# Altium schematic sheet EMoC_Page1.SchDoc
size A4
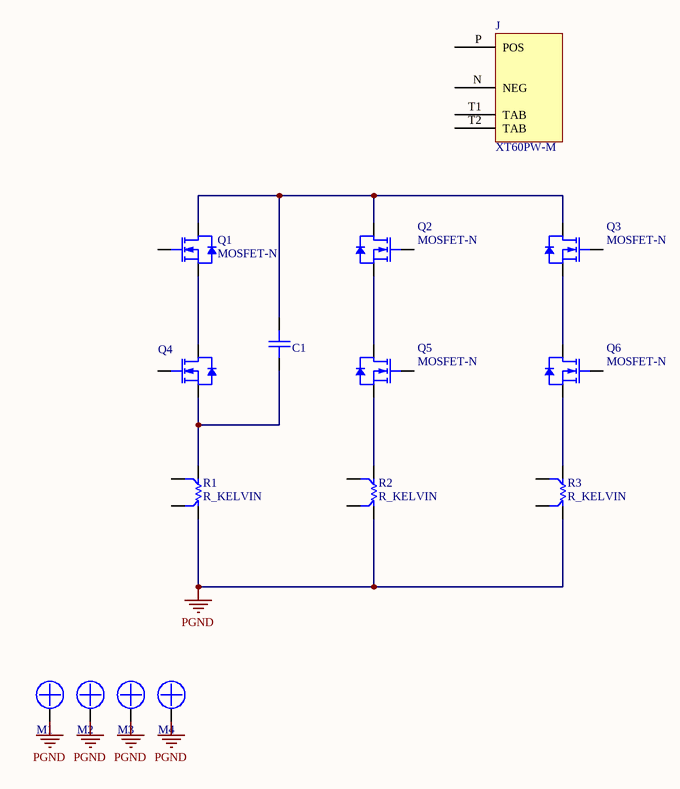
[diagram p0: EMoC_Page1.SchDoc]

## Parts
C1  (no value)  [C0603N]
J  XT60PW-M  [XT60PW-M]
M1  Mounting_Screw  [MOUNT_HOLE_3.2]  (value not drawn)
M2  Mounting_Screw  [MOUNT_HOLE_3.2]  (value not drawn)
M3  Mounting_Screw  [MOUNT_HOLE_3.2]  (value not drawn)
M4  Mounting_Screw  [MOUNT_HOLE_3.2]  (value not drawn)
Q1  MOSFET-N  [DFN-5 (SO-8FL)]
Q2  MOSFET-N  [DFN-5 (SO-8FL)]
Q3  MOSFET-N  [DFN-5 (SO-8FL)]
Q4  MOSFET-N  [DFN-5 (SO-8FL)]  (value not drawn)
Q5  MOSFET-N  [DFN-5 (SO-8FL)]
Q6  MOSFET-N  [DFN-5 (SO-8FL)]
R1  R_KELVIN  [CSS2H-2512N_KELVIN]
R2  R_KELVIN  [CSS2H-2512N_KELVIN]
R3  R_KELVIN  [CSS2H-2512N_KELVIN]

## Nets
PGND: M1.1 M2.1 M3.1 M4.1 R1.1 R2.1 R3.1
NetC1_1: C1.1 Q4.S R1.2
NetC1_2: C1.2 Q1.D Q2.D Q3.D
NetQ1_S: Q1.S Q4.D
NetQ2_S: Q2.S Q5.D
NetQ3_S: Q3.S Q6.D
NetQ5_S: Q5.S R2.2
NetQ6_S: Q6.S R3.2

Not connected (* = marked no-connect by the designer): J N(NEG) P(POS) T1(TAB) T2(TAB); Q1 G; Q2 G; Q3 G; Q4 G; Q5 G; Q6 G; R1 3 4; R2 3 4; R3 3 4

## Library data of the parts
C1 = C
J = XT60PW-M: XT60, Male, THT, R/A